# Altium schematic sheet newIMU.SchDoc
size A4; SheetNumber: 6; SheetTotal: 6
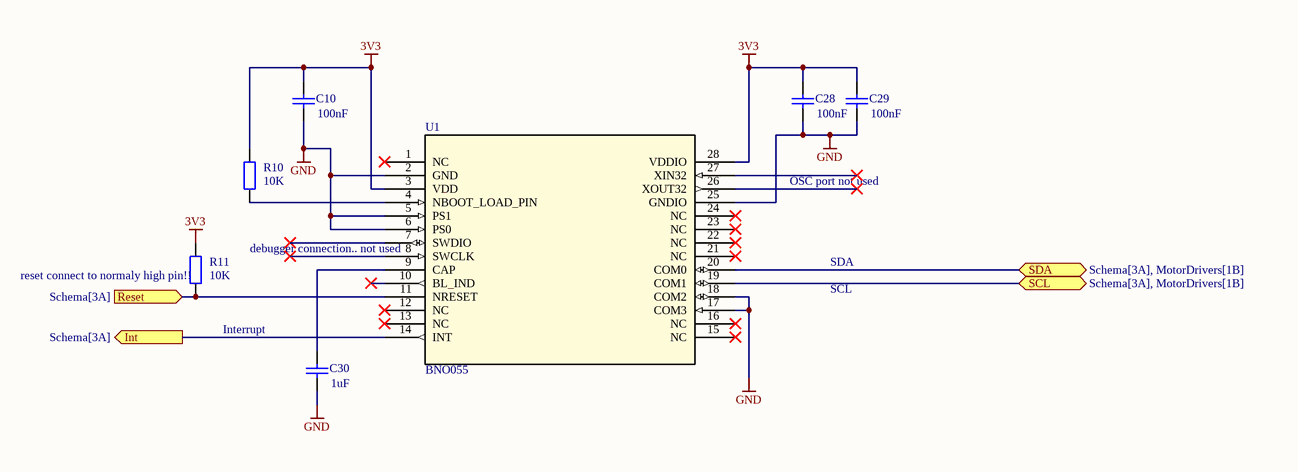
[diagram p0: newIMU.SchDoc]

## Parts
C10  value 100nF  [0805_Lorin]  (hidden comment: Cap)
C28  value 100nF  [0805_Lorin]  (hidden comment: Cap)
C29  value 100nF  [0805_Lorin]  (hidden comment: Cap)
C30  value 1uF  [0805_Lorin]  (hidden comment: Cap)
R10  value 10K  [0805_Lorin]  (hidden comment: Res2)
R11  value 10K  [0805_Lorin]  (hidden comment: Res2)
U1  BNO055  [QFN_BNO055_BOS]

## Ports
Int (out, see Schema[3A]), Reset (in, see Schema[3A]), SCL (bidir, see Schema[3A], MotorDrivers[1B]), SDA (bidir, see Schema[3A], MotorDrivers[1B])

## Nets
3V3: C10.2 C28.2 C29.2 R10.2 R11.2 U1.3(VDD) U1.28(VDDIO)
GND: C10.1 C28.1 C29.1 C30.1 U1.2(GND) U1.5(PS1) U1.6(PS0) U1.17(COM3) U1.18(COM2) U1.25(GNDIO)
Int: U1.14(INT) ; port Int
Reset: R11.1 U1.11(NRESET) ; port Reset
SCL: U1.19(COM1) ; port SCL
SDA: U1.20(COM0) ; port SDA
NetC30_2: C30.2 U1.9(CAP)
NetR10_1: R10.1 U1.4(NBOOT_LOAD_PIN)

Not connected (* = marked no-connect by the designer): U1 1(NC)* 7(SWDIO)* 8(SWCLK)* 10(BL_IND)* 12(NC)* 13(NC)* 15(NC)* 16(NC)* 21(NC)* 22(NC)* 23(NC)* 24(NC)* 26(XOUT32)* 27(XIN32)*

## Notes on the sheet
- OSC port not used
- (near U1) debugger connection.. not used
- (near R11) reset connect to normaly high pin!!
- SCL
- SDA
- Interrupt

## Library data of the parts
C10 C28-C30 = Cap: Capacitor; Published: 8-Jun-2000; LatestRevisionDate: 17-Jul-2002; LatestRevisionNote: Re-released for DXP Platform.; PackageReference: RAD-0.3; Publisher: Altium Limited; PackageDescription: Radial Cap, Thru-Hole; 2 Leads; 0.3 in Pin Spacing
R10 R11 = Res2: Resistor; Published: 8-Jun-2000; LatestRevisionDate: 17-Jul-2002; LatestRevisionNote: Re-released for DXP Platform.; PackageReference: AXIAL-0.4; Publisher: Altium Limited; PackageDescription: Axial Device, Thru-Hole; 2 Leads; 0.4 in Pin Spacing
U1 = BNO055: No Description Available; Mfr_Name: Bosch Sensortec; Copyright: Copyright (C) 2024 Ultra Librarian. All rights reserved.; Manufacturer_Part_Number: BNO055; RefDes: RefDes; Type: DEV